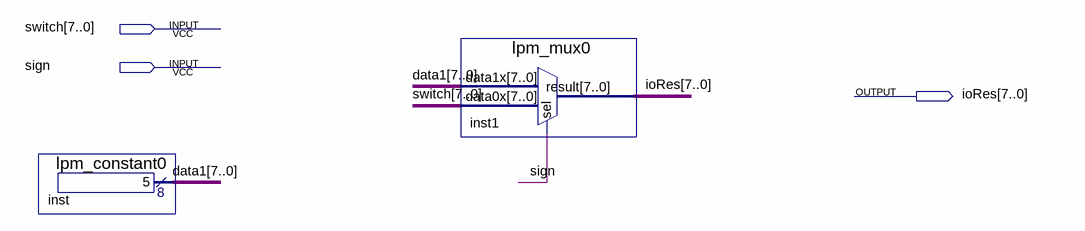
[diagram p0: schematic sheet]
// Quartus schematic ioRead.bdf as structural Verilog: 2 symbols, 3 pins
module ioRead (
  input  [7:0] switch,
  input  sign,
  output [7:0] ioRes
);

  wire [7:0] data1;

  lpm_constant0 inst (.result(data1));
  lpm_mux0 inst1 (.data1x(data1), .data0x(switch), .sel(sign), .result(ioRes));
endmodule
